# EAGLE design control_board_WS2812 (EAGLE 6.3)
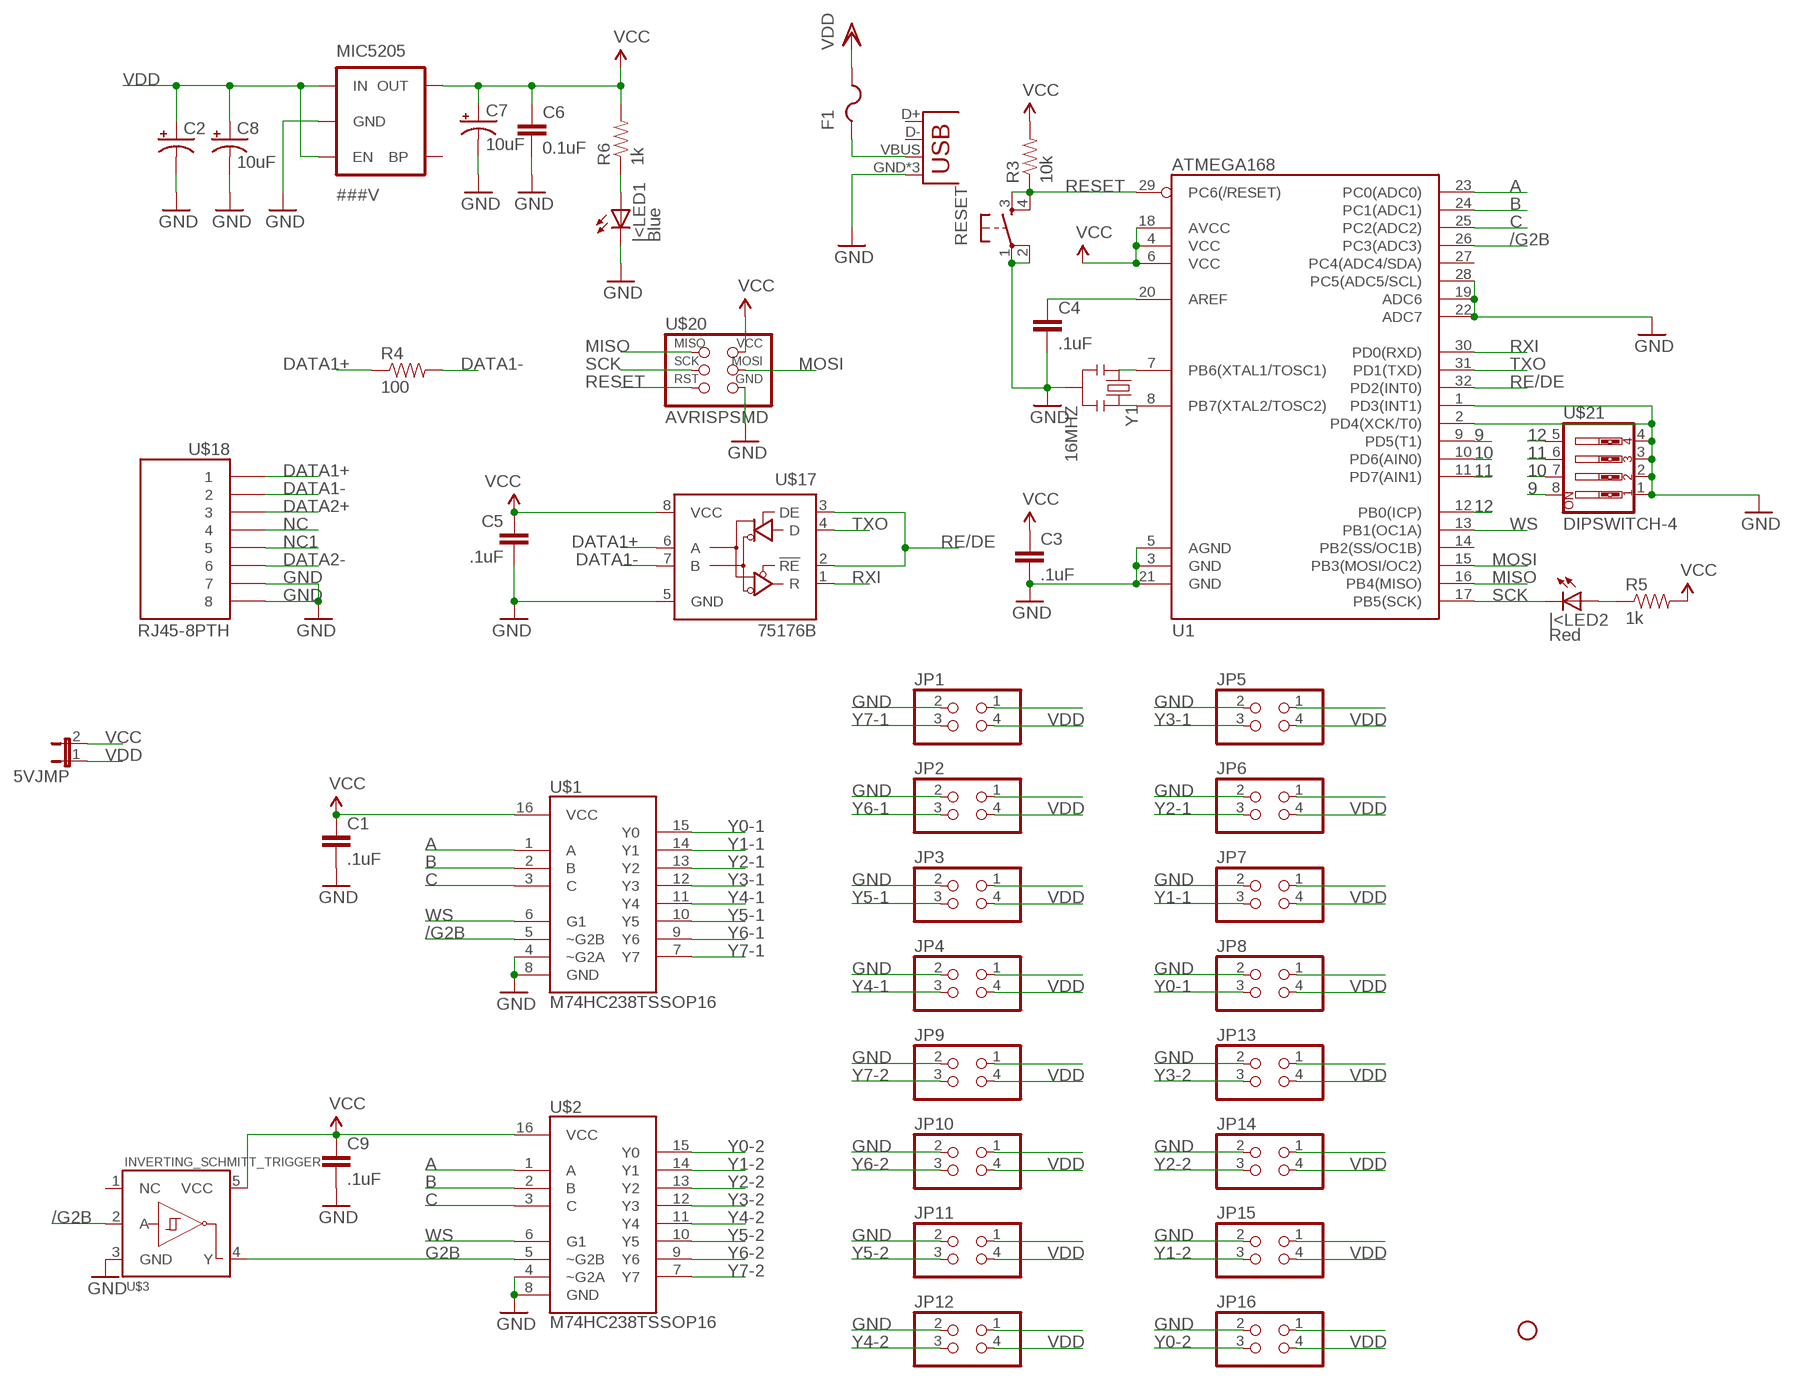
[diagram p0: schematic, sheet 1]

## Parts
5VJMP  JUMPER-2SMD-NO  [SJ_2S-NO]
C1  .1uF  CAP0402-CAP  [0402-CAP]
C2  CAP_POLC  [PANASONIC_C]
C3  .1uF  CAP0402-CAP  [0402-CAP]
C4  .1uF  CAP0402-CAP  [0402-CAP]
C5  .1uF  CAP0402-CAP  [0402-CAP]
C6  0.1uF  CAP0402-CAP  [0402-CAP]
C7  10uF  CAP_POL1206  [EIA3216]
C8  10uF  CAP_POL1206  [EIA3216]
C9  .1uF  CAP0402-CAP  [0402-CAP]
F1  PTCFUSE-1812  [1812]
JP1  PINHD-2X2  [2X02]
JP2  PINHD-2X2  [2X02]
JP3  PINHD-2X2  [2X02]
JP4  PINHD-2X2  [2X02]
JP5  PINHD-2X2  [2X02]
JP6  PINHD-2X2  [2X02]
JP7  PINHD-2X2  [2X02]
JP8  PINHD-2X2  [2X02]
JP9  PINHD-2X2  [2X02]
JP10  PINHD-2X2  [2X02]
JP11  PINHD-2X2  [2X02]
JP12  PINHD-2X2  [2X02]
JP13  PINHD-2X2  [2X02]
JP14  PINHD-2X2  [2X02]
JP15  PINHD-2X2  [2X02]
JP16  PINHD-2X2  [2X02]
JP17  USB-MICROB  [USB-MICROB]
MIC5205  ###V  V_REG_LDOSMD  [SOT23-5]
R3  10k  RESISTOR0402-RES  [0402-RES]
R4  100  RESISTOR1206  [1206]
R5  1k  RESISTOR0402  [C0402]
R6  1k  RESISTOR0402  [C0402]
RESET  TAC_SWITCHSMD  [TACTILE_SWITCH_SMD]
STANDOFF1  STAND-OFF  [STAND-OFF]
U1  ATMEGA168  [TQFP32-08]
U$1  M74HC238TSSOP16  [TSSOP16]
U$2  M74HC238TSSOP16  [TSSOP16]
U$3  INVERTING_SCHMITT_TRIGGER  [TSSOP5]
U$17  75176B  [D_R-PDSO-G8]
U$18  RJ45-8PTH  [RJ45-8]
U$20  AVRISPSMD  [2X03SMD]
U$21  DIPSWITCH-4  [DIPSWITCH-04]
Y1  16MHZ  RESONATOR8MHZ  [RESONATOR-SMD]
|<LED1  Blue  LED0603  [LED-0603]
|<LED2  Red  LED0603  [LED-0603]

## Nets
9: U1.9(PD5(T1)) U$21.8
10: U1.10(PD6(AIN0)) U$21.7
11: U1.11(PD7(AIN1)) U$21.6
12: U1.12(PB0(ICP)) U$21.5
/G2B: U1.26(PC3(ADC3)) U$1.5(~G2B) U$3.2(A)
A: U1.23(PC0(ADC0)) U$1.1(A) U$2.1(A)
B: U1.24(PC1(ADC1)) U$1.2(B) U$2.2(B)
C: U1.25(PC2(ADC2)) U$1.3(C) U$2.3(C)
DATA1+: R4.1 U$17.6(A) U$18.1
DATA1-: R4.2 U$17.7(B) U$18.2
DATA2+: U$18.3
DATA2-: U$18.6
G2B: U$2.5(~G2B) U$3.4(Y)
GND: C1.2 C2.- C3.2 C4.2 C5.2 C6.2 C7.C(-) C8.C(-) C9.2 JP1.2 JP2.2 JP3.2 JP4.2 JP5.2 JP6.2 JP7.2 JP8.2 JP9.2 JP10.2 JP11.2 JP12.2 JP13.2 JP14.2 JP15.2 JP16.2 JP17.GND JP17.MT1(GND) JP17.MT2(GND) MIC5205.2(GND) RESET.1 RESET.2 U1.1(PD3(INT1)) U1.2(PD4(XCK/T0)) U1.3(GND) U1.5(AGND) U1.19(ADC6) U1.21(GND) U1.22(ADC7) U1.28(PC5(ADC5/SCL)) U$1.4(~G2A) U$1.8(GND) U$2.4(~G2A) U$2.8(GND) U$3.3(GND) U$17.5(GND) U$18.7 U$18.8 U$20.6(GND) U$21.1 U$21.2 U$21.3 U$21.4 Y1.2 |<LED1.C
MISO: U1.16(PB4(MISO)) U$20.1(MISO)
MOSI: U1.15(PB3(MOSI/OC2)) U$20.4(MOSI)
N$1: JP1.1
N$2: JP2.1
N$3: C4.1 U1.20(AREF)
N$4: U1.7(PB6(XTAL1/TOSC1)) Y1.1
N$5: U1.8(PB7(XTAL2/TOSC2)) Y1.3
N$7: R5.1 |<LED2.A
N$8: F1.1 JP17.VBUS
N$9: JP3.1
N$14: JP4.1
N$15: JP5.1
N$16: JP6.1
N$17: JP7.1
N$18: JP8.1
N$19: JP9.1
N$20: JP10.1
N$21: JP11.1
N$22: JP12.1
N$23: JP13.1
N$24: JP14.1
N$25: JP15.1
N$26: JP16.1
N$38: R6.1 |<LED1.A
NC: U$18.4
NC1: U$18.5
RE/DE: U1.32(PD2(INT0)) U$17.2(!RE) U$17.3(DE)
RESET: R3.1 RESET.3 RESET.4 U1.29(PC6(/RESET)) U$20.5(RST)
RXI: U1.30(PD0(RXD)) U$17.1(R)
SCK: U1.17(PB5(SCK)) U$20.3(SCK) |<LED2.C
TXO: U1.31(PD1(TXD)) U$17.4(D)
VCC: 5VJMP.2 C1.1 C3.1 C5.1 C6.1 C7.A(+) C9.1 MIC5205.5(OUT) R3.2 R5.2 R6.2 U1.4(VCC) U1.6(VCC) U1.18(AVCC) U$1.16(VCC) U$2.16(VCC) U$3.5(VCC) U$17.8(VCC) U$20.2(VCC)
VDD: 5VJMP.1 C2.+ C8.A(+) F1.2 JP1.4 JP2.4 JP3.4 JP4.4 JP5.4 JP6.4 JP7.4 JP8.4 JP9.4 JP10.4 JP11.4 JP12.4 JP13.4 JP14.4 JP15.4 JP16.4 MIC5205.1(IN) MIC5205.3(EN)
WS: U1.13(PB1(OC1A)) U$1.6(G1) U$2.6(G1)
Y0-1: JP8.3 U$1.15(Y0)
Y0-2: JP16.3 U$2.15(Y0)
Y1-1: JP7.3 U$1.14(Y1)
Y1-2: JP15.3 U$2.14(Y1)
Y2-1: JP6.3 U$1.13(Y2)
Y2-2: JP14.3 U$2.13(Y2)
Y3-1: JP5.3 U$1.12(Y3)
Y3-2: JP13.3 U$2.12(Y3)
Y4-1: JP4.3 U$1.11(Y4)
Y4-2: JP12.3 U$2.11(Y4)
Y5-1: JP3.3 U$1.10(Y5)
Y5-2: JP11.3 U$2.10(Y5)
Y6-1: JP2.3 U$1.9(Y6)
Y6-2: JP10.3 U$2.9(Y6)
Y7-1: JP1.3 U$1.7(Y7)
Y7-2: JP9.3 U$2.7(Y7)
Unconnected: JP17.D+ JP17.D- MIC5205.4(BP) U1.14(PB2(SS/OC1B)) U1.27(PC4(ADC4/SDA)) U$3.1(NC)

## Library data of the parts
5VJMP = SparkFun-Passives:JUMPER-2: Jumper Basic 0.1" spaced jumper. Use with breakaway headers.
C1 C3-C6 C9 = SparkFun-Capacitors:CAP: Capacitor Standard 0603 ceramic capacitor, and 0.1" leaded capacitor.
C2 = SparkFun-Capacitors:CAP_POL: Capacitor Polarized These are standard SMD and PTH capacitors. Normally 10uF, 47uF, and 100uF in electrolytic and tantalum varieties. Always verify the external diameter of the through hole cap, it varies with capacity, voltage, and manufacturer. The EIA devices should be standard.
C7 C8 = SparkFun:CAP_POL: Capacitor Polarized These are standard SMD and PTH capacitors. Normally 10uF, 47uF, and 100uF in electrolytic and tantalum varieties. Always verify the external diameter of the through hole cap, it varies with capacity, voltage, and manufacturer. The EIA devices should be standard.
F1 = adafruit:PTCFUSE: PTC fuses, resettable thermistors
JP1-JP16 = pinhead:PINHD-2X2: PIN HEADER
JP17 = SparkFun-Connectors:USB: USB Connectors USB-B-PTH is fully proven SKU : PRT-00139/CONN-08278 USB-miniB is fully proven SKU : PRT-00587 USB-A-PCB is untested. USB-A-H is throughly reviewed, but untested. Spark Fun Electronics SKU : PRT-00437 USB-B-SMT is throughly reviewed, but untested. Needs silkscreen touching up. USB-A-S has not been used/tested USB-MB-H has not been used/tested USB-MICROB has been used. CONN-09505; PROD_ID: CONN-09505
MIC5205 = SparkFun:V_REG_LDO: Voltage Regulator LDO Standard 150mA LDO voltage regulator in SOT-23 layout. Micrel part MIC5205. BP (by-pass) pin is used to lower output noise with 470pF cap.
R3 R4 = SparkFun-Passives:RESISTOR: Resistor
R5 R6 = SparkFun:RESISTOR: Resistor
RESET = SparkFun-Electromechanical:TAC_SWITCH: Momentary Switch Button commonly used for reset or general input. Spark Fun Electronics SKU : COM-00097 SMT- SWCH-08247; PROD_ID: SWCH-08247
STANDOFF1 = SparkFun-Electromechanical:STAND-OFF: #4 Stand Off This is the mechanical footprint for a #4 phillips button head screw. Use the keepout ring to avoid running the screw head into surrounding components. SKU : PRT-00447
U1 = SparkFun-DigitalIC:ATMEGA168: Atmel 32-pin 8-bit micro, 16k flash.
U$1 U$2 = SparkFun-DigitalIC:M74HC238: M74HC238 - CMOS 3 TO 8 LINE DECODER
U$3 = SparkFun-DigitalIC:INVERTING_SCHMITT_TRIGGER: FAIRCHILD Inverting Schmitt Trigger UNTESTED FOOTPRINT!! Used in External Clock Sources. Digikey P/N NC7SZ14M5XCT-ND
U$17 = 751xx:75176B: 75176B
U$18 = SparkFun-Connectors:RJ45-8: RJ45 Jack Simple RJ45, 8-pin connection - connector for common Cat5, Cat5e, and Cat6 Ethernet cables. Footprint not yet proven in production. Connector sku is PRT-00643; Breakout PCB sku is BOB-00716.
U$20 = fab:AVRISP
U$21 = SparkFun-Electromechanical:DIPSWITCH-4
Y1 = SparkFun-FreqCtrl:RESONATOR: Resonator Small SMD resonator. Used, eg, on the Arduino Pro/ Pro Mini boards. 8MHz- XTAL-08895 16MHz- XTAL-08900; PROD_ID: XTAL-08895; VALUE: 8MHZ
|<LED1 |<LED2 = SparkFun:LED: LEDs Standard schematic elements and footprints for 5mm, 3mm, 1206, and 0603 sized LEDs. 5mm - Spark Fun Electronics SKU : COM-00529 (and others)

## Net classes
1 vcc: width 0.254 mm

## Board
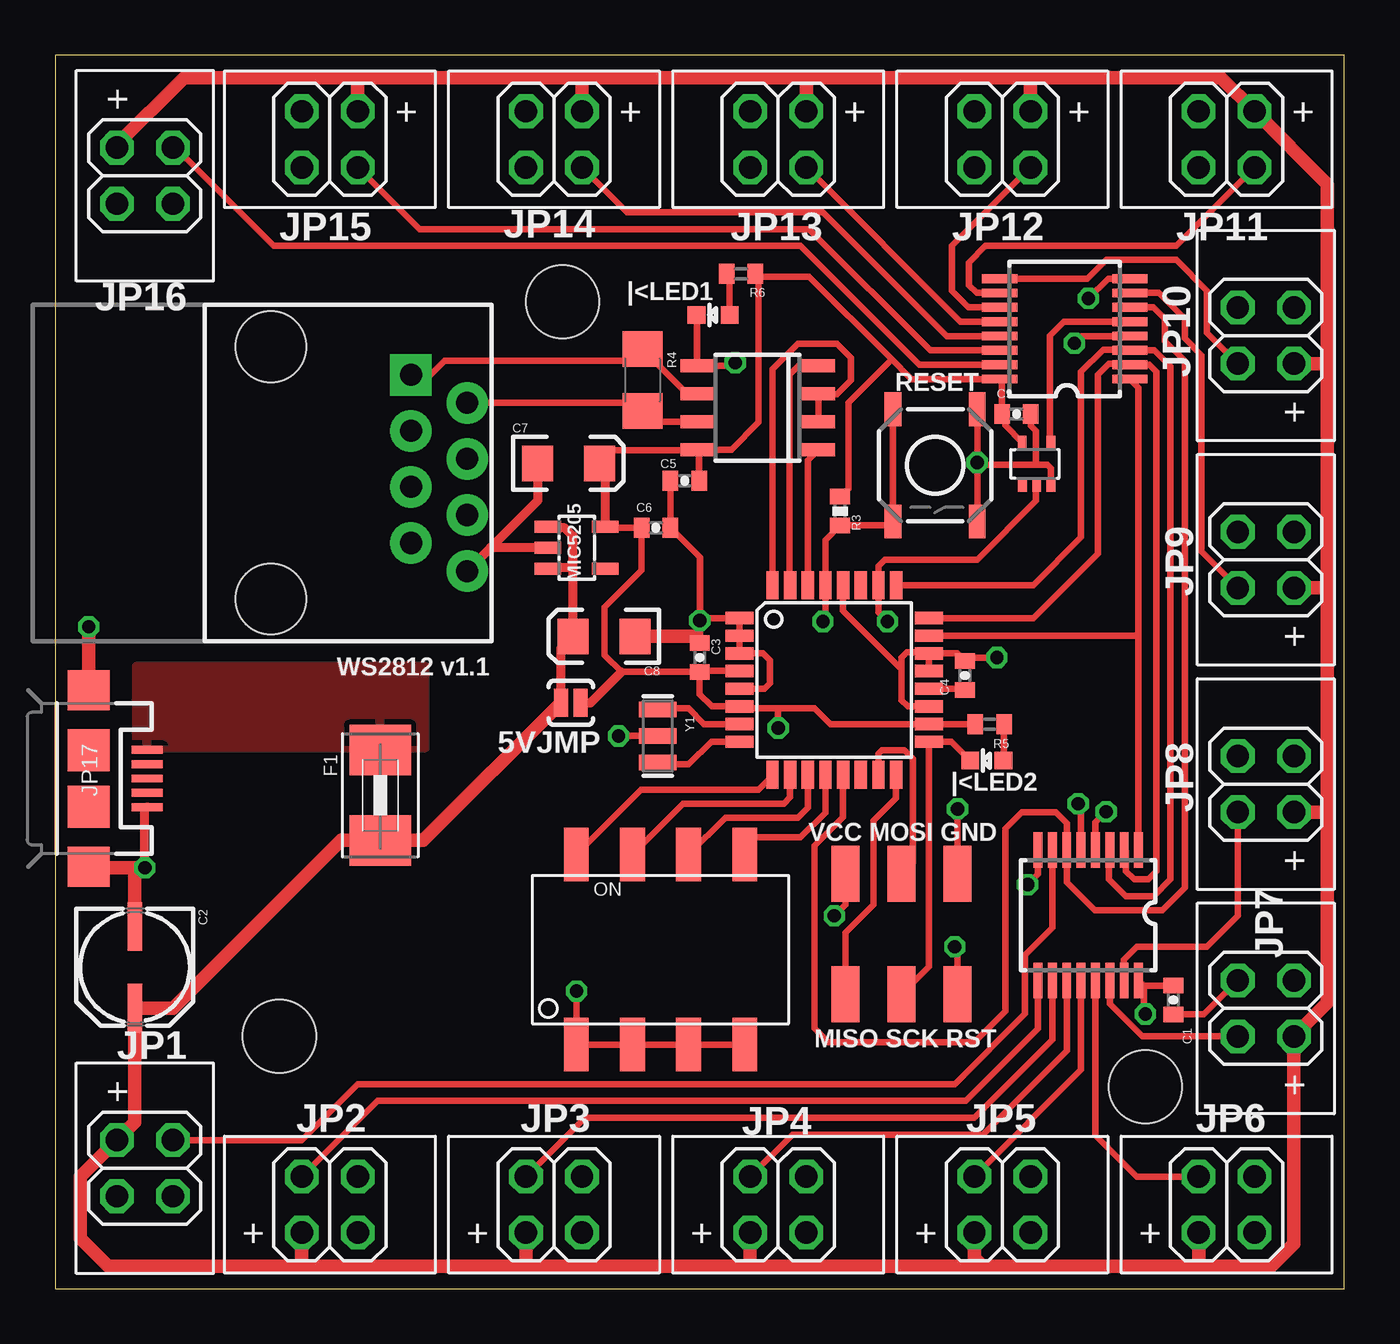
[diagram p1: board, top side]
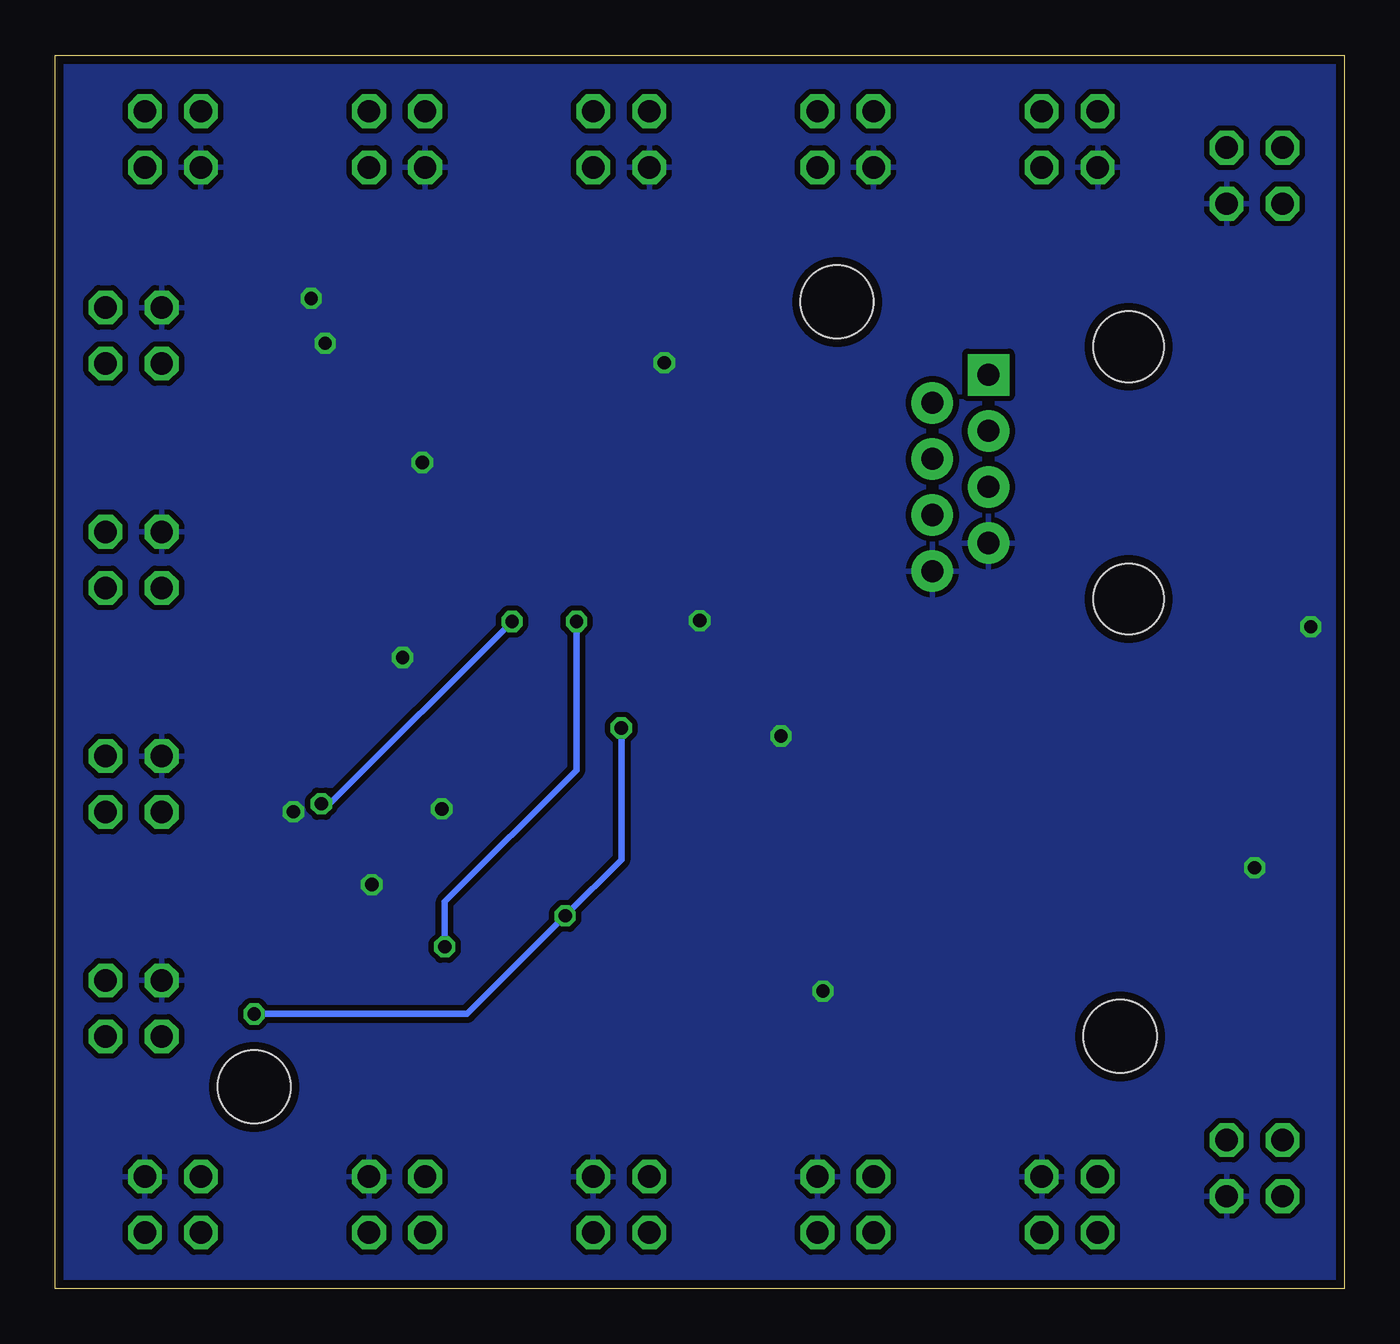
[diagram p2: board, bottom side, seen from below]

Size 58.42 x 55.88 mm. Coordinates in mm from the lower left corner, seen from the top.
Outline: 0,0 58.42,0 58.42,55.88 0,55.88 0,0
Copper layers (1*16): Top 0.0356mm / dielectric 1.5011mm / Bottom 0.0356mm
Design rules "LaenPCBOrder *": minimum track width 6mil, minimum drill 13mil, track to track 10mil, track to pad 6mil, pad to pad 6mil, via to via 6mil, smd to smd 6mil, copper to edge 15mil, drill to drill 6mil, minimum pad ring 7mil, minimum via ring 7mil, stop-mask expansion 4mil, vias tented up to drill 0mil, thermal gap 10mil

### Footprints (pad centres in the part's own frame; a part is rotated, then mirrored left to right if it is on the bottom)
SJ_2S-NO = smd 0.635 x 1.27: 1 -0.45,0; 2 0.45,0
0402-CAP = smd 0.7 x 0.9: 1 -0.65,0; 2 0.65,0
PANASONIC_C = smd 2.2 x 0.65: + 1.9,-0.2; - -1.8,-0.2
EIA3216 = smd 1.4 x 1.6: A 1.4,0; C -1.4,0
1812 = smd 2.286 x 2.794: 1 -2.046,0; 2 2.046,0
2X02 = drill 1.016 octagon: 1 -1.27,1.27; 2 -1.27,-1.27; 3 1.27,-1.27; 4 1.27,1.27
USB-MICROB = smd 0.35 x 1.4: D+ 0,2.65; D- -0.65,2.65; GND 1.3,2.65; ID 0.65,2.65; VBUS -1.3,2.65 | smd 1.8 x 1.9: MT1 -4,0; MT2 4,0 | smd 1.9 x 1.9: P$1 -1.27,0; P$2 1.27,0
SOT23-5 = smd 0.55 x 1.2: 1 -0.95,-1.3; 2 0,-1.3; 3 0.95,-1.3; 4 0.95,1.3; 5 -0.95,1.3
0402-RES = smd 0.7 x 0.9: 1 -0.65,0; 2 0.65,0
1206 = smd 1.6 x 1.8: 1 -1.4,0; 2 1.4,0
C0402 = smd 0.7 x 0.9: 1 -0.65,0; 2 0.65,0
TACTILE_SWITCH_SMD = smd 1.524 x 0.762: 1 -2.54,1.905; 2 2.54,1.905; 3 -2.54,-1.905; 4 2.54,-1.905
STAND-OFF = hole 3.302: 0,0
TQFP32-08 = smd 1.27 x 0.559: 1 -4.293,2.8; 2 -4.293,2; 3 -4.293,1.2; 4 -4.293,0.4; 5 -4.293,-0.4; 6 -4.293,-1.2; 7 -4.293,-2; 8 -4.293,-2.8; 17 4.293,-2.8; 18 4.293,-2; 19 4.293,-1.2; 20 4.293,-0.4; 21 4.293,0.4; 22 4.293,1.2; 23 4.293,2; 24 4.293,2.8 | smd 0.559 x 1.27: 9 -2.8,-4.293; 10 -2,-4.293; 11 -1.2,-4.293; 12 -0.4,-4.293; 13 0.4,-4.293; 14 1.2,-4.293; 15 2,-4.293; 16 2.8,-4.293; 25 2.8,4.293; 26 2,4.293; 27 1.2,4.293; 28 0.4,4.293; 29 -0.4,4.293; 30 -1.2,4.293; 31 -2,4.293; 32 -2.8,4.293
TSSOP16 = smd 0.4 x 1.6: 1 -2.225,-2.85; 2 -1.575,-2.85; 3 -0.925,-2.85; 4 -0.275,-2.85; 5 0.375,-2.85; 6 1.025,-2.85; 7 1.675,-2.85; 8 2.325,-2.85; 9 2.325,3.05; 10 1.675,3.05; 11 1.025,3.05; 12 0.375,3.05; 13 -0.275,3.05; 14 -0.925,3.05; 15 -1.575,3.05; 16 -2.225,3.05
TSSOP5 = smd 0.55 x 0.4: 1 -1.04,0.57; 2 -1.04,-0.08; 3 -1.04,-0.73; 4 0.95,-0.73; 5 0.94,0.58
D_R-PDSO-G8 = smd 0.6 x 1.5: 1 -1.905,-2.75; 2 -0.635,-2.75; 3 0.635,-2.75; 4 1.905,-2.75; 5 1.905,2.75; 6 0.635,2.75; 7 -0.635,2.75; 8 -1.905,2.75
RJ45-8 = drill 1 pad 1.88 square: 1 -4.445,6.35 | drill 1 pad 1.88: 2 -3.175,8.89; 3 -1.905,6.35; 4 -0.635,8.89; 5 0.635,6.35; 6 1.905,8.89; 7 3.175,6.35; 8 4.445,8.89 | hole 3.2: -5.715,0; 5.715,0
2X03SMD = smd 2.54 x 1.27: 1 -2.54,2.54; 2 2.92,2.54; 3 -2.54,0; 4 2.92,0; 5 -2.54,-2.54; 6 2.92,-2.54
DIPSWITCH-04 = smd 1.118 x 2.438: 1 -3.81,-4.305; 2 -1.27,-4.305; 3 1.27,-4.305; 4 3.81,-4.305; 5 3.81,4.305; 6 1.27,4.305; 7 -1.27,4.305; 8 -3.81,4.305
RESONATOR-SMD = smd 0.7 x 1.7: 1 -1.2,0; 2 0,0; 3 1.2,0
LED-0603 = smd 0.8 x 0.8: A 0,-0.75; C 0,0.75

### Placement (x,y rotation side)
5VJMP  23.37,26.54 0 top
C1  50.67,13.08 270 top
C2  3.81,14.61 270 top
C3  29.21,28.6 90 top
C4  41.22,27.78 90 top
C5  28.53,36.61 180 top
C6  27.23,34.47 0 top
C7  23.26,37.39 0 top
C8  24.87,29.55 180 top
C9  43.56,39.62 0 top
F1  14.73,22.35 270 top
JP1  4.06,5.46 90 top
JP2  12.45,3.81 180 top
JP3  22.61,3.81 180 top
JP4  32.77,3.81 180 top
JP5  42.93,3.81 180 top
JP6  53.09,3.81 180 top
JP7  54.86,12.7 270 top
JP8  54.86,22.86 270 top
JP9  54.86,33.02 270 top
JP10  54.86,43.18 270 top
JP11  53.09,52.07 0 top
JP12  42.93,52.07 0 top
JP13  32.77,52.07 0 top
JP14  22.61,52.07 0 top
JP15  12.45,52.07 0 top
JP16  4.06,50.42 90 top
JP17  1.52,23.11 270 top
MIC5205  23.63,33.57 270 top
R3  35.57,35.23 90 top
R4  26.62,41.17 270 top
R5  42.34,25.57 180 top
R6  31.08,45.99 0 top
RESET  39.88,37.3 270 top
STANDOFF1  22.99,44.7 0 top
STANDOFF2  STAND-OFF  [STAND-OFF]  49.4,9.14 0 top
STANDOFF3  STAND-OFF  [STAND-OFF]  10.16,11.43 0 top
U1  35.31,27.58 0 top
U$1  46.86,17.02 180 top
U$2  45.85,43.43 90 top
U$3  44.4,37.42 90 top
U$17  31.83,39.91 90 top
U$18  9.78,36.96 270 top
U$20  38.35,15.88 90 top
U$21  27.43,15.37 0 top
Y1  27.31,25.04 270 top
|<LED1  29.81,44.12 90 top
|<LED2  42.22,23.92 90 top

### Tracks (layer width: path | path; a pad name or v marks a point on that pad's centre or on a via)
9
  Top 0.305: U1.9 32.51,23.24 31.88,22.61 26.56,22.61 U$21.8
10
  Top 0.305: U1.10 33.31,22.26 33.02,21.97 28.46,21.97 U$21.7
11
  Top 0.305: U1.11 34.11,21.79 33.66,21.34 30.37,21.34 U$21.6
12
  Top 0.305: U1.12 34.91,21.57 33.78,20.45 31.24,20.45 U$21.5
/G2B  (via drill 0.6)
  Top 0.305: U$3.2 44.45,36.35 44.45,35.69 41.78,33.02 37.59,33.02 37.31,32.74 U1.26 37.31,30.64 v37.72,30.23 | U$1.5 46.49,21.84 v46.36,21.97
  Bottom 0.305: v46.36,21.97 45.97,21.97 v37.72,30.23
A
  Top 0.305: U$1.1 49.09,29.72 | 49.09,29.72 49.09,40.82 U$2.1 | U1.23 48.95,29.58 49.09,29.72
B
  Top 0.305: U$1.2 48.51,19.79 48.51,18.92 48.9,18.54 49.53,18.54 49.91,18.92 49.91,41.53 49.58,41.86 U$2.2 48.65,41.91 47.75,41.91 47.24,41.4 47.24,33.3 44.32,30.38 U1.24
C
  Top 0.305: U$1.3 47.75,19.83 47.75,18.54 48.51,17.78 49.78,17.78 50.55,18.54 50.55,41.78 49.82,42.51 U$2.3 48.66,42.55 47.5,42.55 46.48,41.53 46.48,34.04 44.32,31.88 40.01,31.88 40,31.87 U1.25
DATA1+
  Top 0.305: 29.07,40.56 U$17.6 28.64,40.55 R4.1 26.09,42.04 17.65,42.04 17.02,41.4 U$18.1
DATA1-
  Top 0.305: U$17.7 27.11,39.27 R4.2 26.25,40.13 U$18.2
G2B
  Top 0.305: U$2.5 45.72,43.81 45.09,43.17 45.09,38.41 U$3.4
GND  (via drill 0.6)
  Top 0.305: U1.5 32.13,27.18 32.39,27.43 32.39,28.47 32.08,28.78 U1.3 U1.2 U1.1 29.32,30.38 v29.21,30.27 | C3.2 v29.21,30.27 | Y1.2 v25.53,25.04 | v30.82,41.94 30.69,41.81 U$17.5 29.08,44.1 |<LED1.C | U$21.4 U$21.3 U$21.2 U$21.1 v23.62,13.48 | U1.22 U1.21 | 41.87,40.26 RESET.1 v41.78,37.43 | C1.2 52.05,12.43 JP7.2 | U1.22 40.88,28.78 C4.2 41.39,28.59 v42.67,28.59 | U1.19 38.65,26.38 38.35,26.67 38.35,28.07 | 38.35,28.07 38.35,28.57 38.61,28.83 39.55,28.83 U1.22 | U$3.3 45.13,37.17 44.96,37.34 44.45,37.34 | U$2.4 46.51,43.16 v46.18,42.83 | U$2.8 47.72,45.76 v46.82,44.86 | U$20.6 v40.9,21.74 | U$1.8 44.54,18.78 v44.07,18.31 | C5.2 C6.2 29.21,33.13 v29.21,30.27 | U$1.4 47.14,21.12 v47.63,21.61 | 44.45,37.34 41.87,37.34 v41.78,37.43 | RESET.2 v41.78,37.43 | C9.2 44.21,39.1 44.45,38.86 44.45,37.34 | U1.28 35.71,30.71 38.35,28.07
  Top 0.406: MIC5205.2 19.73,33.57 | 19.73,33.57 U$18.8 | C7.C 21.86,35.7 19.73,33.57 | v4.07,19.07 4.07,21.71 JP17.GND
  Top 0.61: 25.35,25.04 v25.53,25.04 | C8.C 28.91,29.55 C3.2 | v4.07,19.07 3.56,19.07 | 3.56,19.07 1.57,19.07 JP17.MT2 | C2.- 3.61,19.02 3.56,19.07 | v1.53,29.99 JP17.MT1
  pour Bottom: 0,0 0,55.88 58.42,55.88 58.42,0
MISO
  Top 0.305: U$20.1 35.81,16.13 37.08,17.4 37.08,21.21 38.1,22.23 U1.16
MOSI
  Top 0.305: U1.15 37.31,24.23 37.47,24.38 38.48,24.38 38.86,24 38.86,19.3 U$20.4
N$3
  Top 0.305: U1.20 41.05,27.18 C4.1
N$4
  Top 0.305: U1.7 29.41,25.58 28.7,26.29 27.36,26.29 Y1.1
N$5
  Top 0.305: U1.8 29.73,24.78 28.7,23.75 27.4,23.75 Y1.3
N$7
  Top 0.305: R5.1 42.99,23.95 |<LED2.A
N$8
  pour Top: 3.68,24.51 16.76,24.51 16.76,28.19 3.68,28.19
N$38
  Top 0.305: |<LED1.A 30.56,45.86 R6.1
RE/DE
  Top 0.305: U$17.2 U$17.3 34.62,40.51 35.43,40.51 36.07,41.15 36.07,42.16 35.43,42.8 33.66,42.8 32.51,41.65 U1.32
RESET  (via drill 0.6)
  Top 0.305: RESET.3 RESET.4 37.79,34.58 R3.1 34.91,33.92 U1.29 34.91,30.34 v34.8,30.23 | U$20.5 40.89,15.37 v40.77,15.49
  Bottom 0.305: v40.77,15.49 40.77,17.53 34.8,23.5 v34.8,30.23
RXI
  Top 0.305: U1.30 34.11,37.53 U$17.1
SCK
  Top 0.305: U$20.3 39.6,14.58 U1.17 40.61,24.78 |<LED2.C
TXO
  Top 0.305: U$17.4 33.69,41.81 33.27,41.4 33.27,31.91 U1.31
VCC  (via drill 0.6)
  Top 0.305: U1.4 30.99,28 29.27,28 C3.1 | C5.1 29.18,37.91 U$17.8 | C1.1 49.33,13.73 | 49.33,13.73 U$1.16 | U$17.8 30.64,38.01 31.88,39.24 31.88,45.84 | 37.85,42.16 34.17,45.84 31.88,45.84 | 37.85,42.16 38.8,41.21 U$2.16 42.91,41.09 C9.1 43.06,39.48 43.06,39.12 U$3.5 | U$17.8 29.05,37.97 25.25,37.97 C7.A | C3.1 29.21,26.92 29.75,26.38 U1.6 31.11,26.29 32.77,26.29 | 37.85,42.16 37.85,42.04 35.94,40.13 35.94,36.25 R3.2 | 32.77,26.29 34.42,26.29 35.13,25.58 U1.18 R5.2 | MIC5205.5 24.98,34.47 C6.1 26.57,32.54 24.89,30.86 24.89,28.7 25.65,27.94 C3.1 | 31.88,45.84 R6.2 | U$20.2 35.81,17.4 v35.31,16.89 | 49.33,13.73 49.33,12.52 v49.4,12.45 | v32.77,25.4 32.77,26.29
  Top 0.406: MIC5205.5 24.93,37.12 C7.A | 5VJMP.2 24.26,26.54 25.65,27.94
  Bottom 0.305: v32.77,25.4 32.77,19.43 v35.31,16.89 39.75,12.45 v49.4,12.45
VDD
  Top 0.406: MIC5205.3 22.38,32.67 23.43,32.67 23.47,32.64 | MIC5205.1 22.68,34.52 22.73,34.47 23.09,34.47 23.47,34.09 23.47,32.64 | 23.47,32.64 C8.A 22.92,29 5VJMP.1
  Top 0.61: 11.18,1.02 2.41,1.02 1.14,2.29 1.14,5.08 JP1.4 3.61,7.55 C2.+ 5.34,12.71 12.95,20.32 14.72,20.32 F1.2 16.68,20.31 5VJMP.1 | 11.18,1.02 21.46,1.02 | 21.46,1.02 31.62,1.02 | 31.62,1.02 42.04,1.02 | 42.04,1.02 51.82,1.02 | 51.82,1.02 55.12,1.02 56.13,2.03 JP7.4 57.66,12.95 57.66,21.46 | 21.46,1.02 21.34,1.14 JP3.4 | 57.66,21.46 57.66,31.75 | 57.66,31.75 57.66,41.78 | 57.66,41.78 57.66,50.04 JP11.4 52.83,54.86 44.07,54.86 | JP8.4 57.53,21.59 57.66,21.46 | 13.72,54.86 5.84,54.86 2.79,51.82 JP16.4 | 13.72,54.86 24,54.86 | 24,54.86 33.91,54.86 | 33.91,54.86 44.07,54.86 | 44.07,54.86 44.2,54.74 JP12.4 | 33.91,54.86 34.04,54.74 JP13.4 | JP15.4 13.72,54.86 | JP14.4 23.88,54.74 24,54.86 | JP10.4 57.53,41.91 57.66,41.78 | JP9.4 57.66,31.75 | JP6.4 51.82,1.02 | JP5.4 41.66,1.4 42.04,1.02 | JP4.4 31.5,1.14 31.62,1.02 | JP2.4 11.18,1.02
WS
  Top 0.305: U$2.6 49.78,44.46 50.29,43.94 50.29,42.93 51.18,42.04 51.18,18.16 50.16,17.14 47.12,17.14 45.85,18.41 U$1.6 45.84,21.09 45.34,21.59 43.82,21.59 43.05,20.83 43.05,12.57 41.66,11.18 35.05,11.18 34.42,11.81 34.42,20.07 35.71,21.36 U1.13
Y0-1
  Top 0.305: U$1.15 48.44,14.91 49.02,15.49 52.2,15.49 53.59,16.89 JP8.3
Y0-2
  Top 0.305: U$2.15 39.17,41.86 33.78,47.24 9.91,47.24 5.46,51.69 JP16.3
Y1-1
  Top 0.305: U$1.14 47.79,12.92 49.28,11.43 JP7.3
Y1-2
  Top 0.305: U$2.14 39.66,42.51 34.16,48.01 16.51,48.01 JP15.3
Y2-1
  Top 0.305: U$1.13 47.14,6.96 49.02,5.08 JP6.3
Y2-2
  Top 0.305: U$2.13 40.41,43.16 34.8,48.77 25.91,48.77 JP14.3
Y3-1
  Top 0.305: U$1.12 46.49,9.91 JP5.3
Y3-2
  Top 0.305: U$2.12 41.03,43.81 JP13.3
Y4-1
  Top 0.305: U$1.11 45.84,10.79 42.04,6.99 33.4,6.99 JP4.3
Y4-2
  Top 0.305: U$2.11 41.39,44.46 40.64,45.21 40.64,47.24 JP12.3
Y5-1
  Top 0.305: U$1.10 45.19,11.28 41.66,7.75 24,7.75 JP3.3
Y5-2
  Top 0.305: U$2.10 41.76,45.11 41.4,45.47 41.4,46.48 42.16,47.24 50.8,47.24 JP11.3
Y6-1
  Top 0.305: U$1.9 44.54,11.77 41.28,8.51 14.61,8.51 JP2.3
Y6-2
  Top 0.305: U$2.9 46.78,45.76 47.62,46.61 50.8,46.61 52.2,45.21 52.2,43.31 JP10.3
Y7-1
  Top 0.305: U$1.7 45.19,16.36 43.94,15.11 43.94,12.45 40.77,9.27 13.72,9.27 11.18,6.73 JP1.3
Y7-2
  Top 0.305: U$2.7 50.01,45.11 51.18,43.94 51.18,43.05 51.94,42.29 51.94,33.4 JP9.3

### Text on the board
tPlace: WS2812 v1.1
tNames: VCC MOSI GND / / / / / MISO SCK RST